# EAGLE design untitled (EAGLE 6.1)
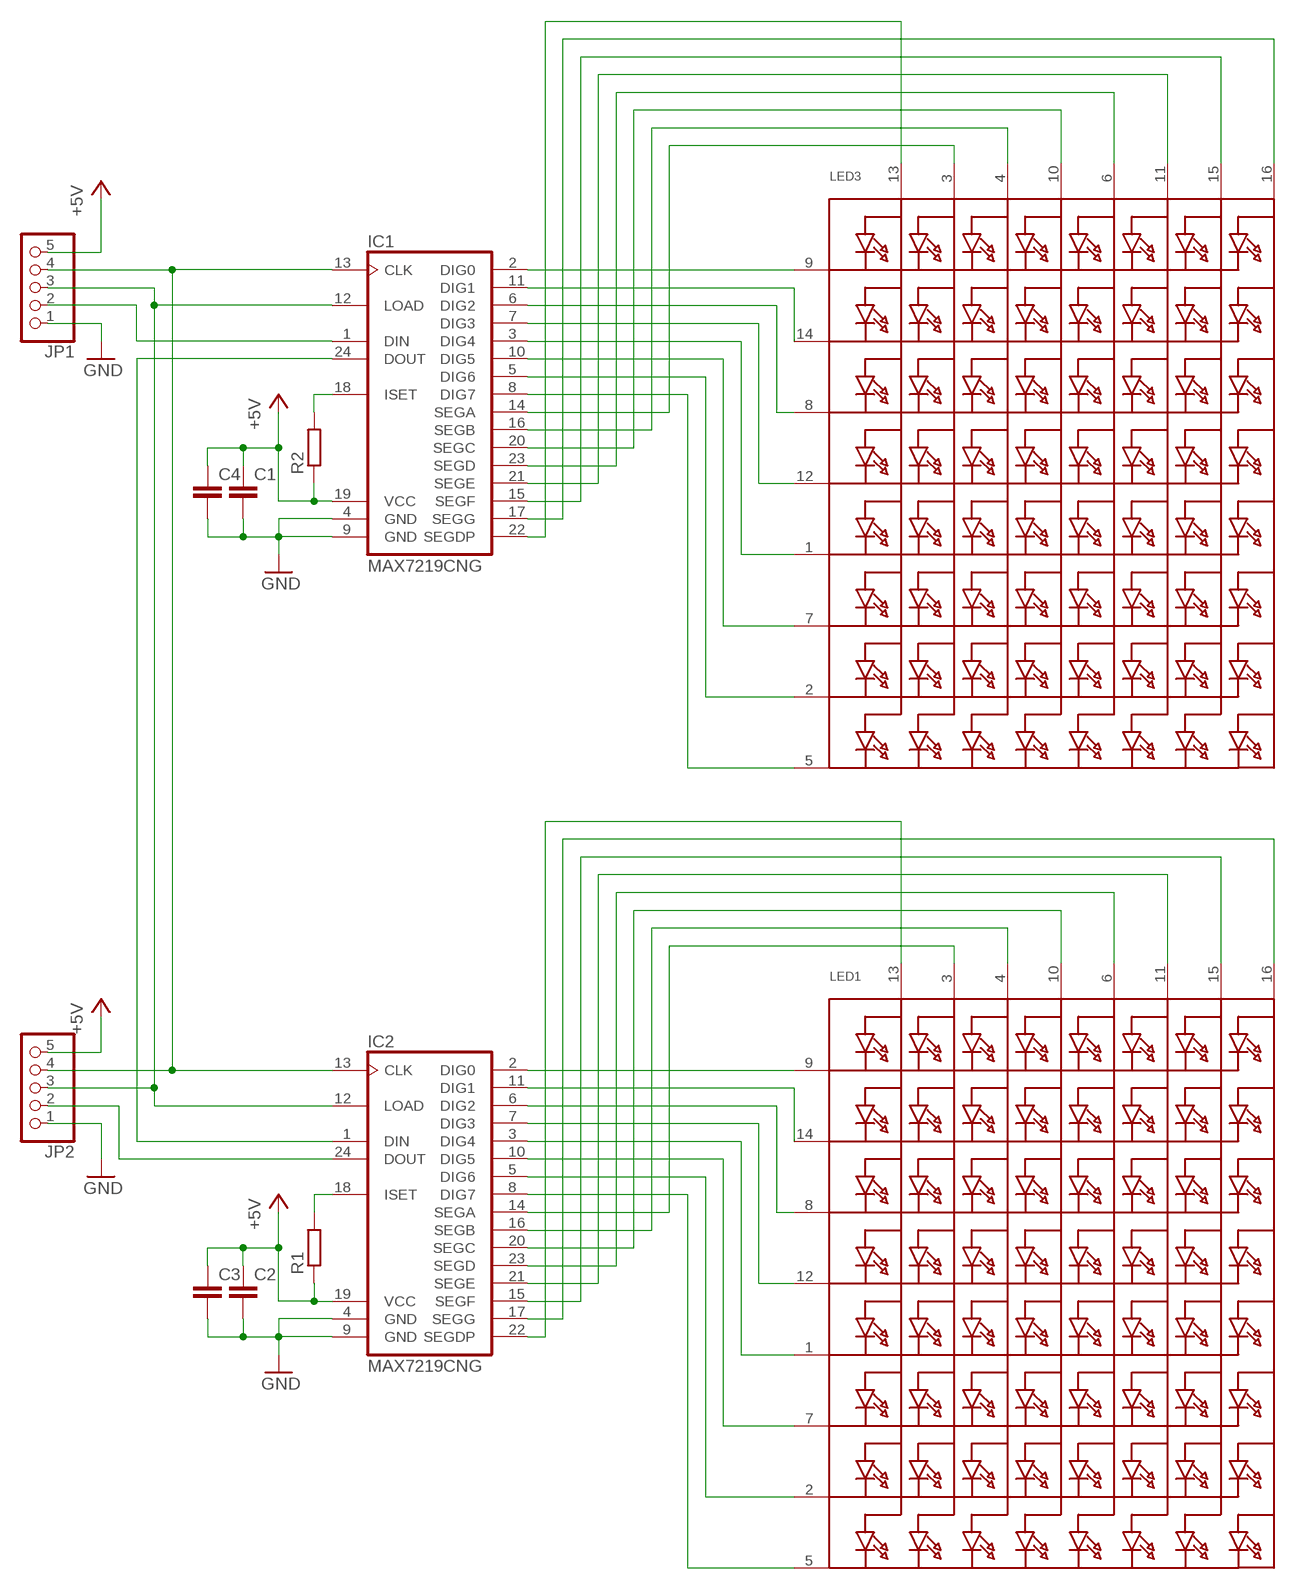
[diagram p0: schematic, sheet 1]

## Parts
C1  C-EUC0805K  [C0805K]
C2  C-EUC0805K  [C0805K]
C3  C-EUC0805K  [C0805K]
C4  C-EUC0805K  [C0805K]
IC1  MAX7219CNG  [DIL24-3]
IC2  MAX7219CNG  [DIL24-3]
JP1  PINHD-1X5/90  [1X05/90]
JP2  PINHD-1X5/90  [1X05/90]
LED1  SEGMENT_8X8_ROWCATHODEM12A881UR  [SEGMENT_BL-M12A881UR]
LED3  SEGMENT_8X8_ROWCATHODEM12A881UR  [SEGMENT_BL-M12A881UR]
R1  R-EU_M0805  [M0805]
R2  R-EU_M0805  [M0805]

## Nets
+5V: C1.1 C2.1 C3.1 C4.1 IC1.19(VCC) IC2.19(VCC) JP1.5 JP2.5 R1.1 R2.1
GND: C1.2 C2.2 C3.2 C4.2 IC1.4(GND) IC1.9(GND) IC2.4(GND) IC2.9(GND) JP1.1 JP2.1
N$1: IC1.2(DIG0) LED3.9(K1)
N$2: IC1.11(DIG1) LED3.14(K2)
N$3: IC1.6(DIG2) LED3.8(K3)
N$4: IC1.7(DIG3) LED3.12(K4)
N$5: IC1.3(DIG4) LED3.1(K5)
N$6: IC1.10(DIG5) LED3.7(K6)
N$7: IC1.5(DIG6) LED3.2(K7)
N$8: IC1.8(DIG7) LED3.5(K8)
N$9: IC1.14(SEGA) LED3.3(A2)
N$10: IC1.16(SEGB) LED3.4(A3)
N$11: IC1.20(SEGC) LED3.10(A4)
N$12: IC1.23(SEGD) LED3.6(A5)
N$13: IC1.21(SEGE) LED3.11(A6)
N$14: IC1.15(SEGF) LED3.15(A7)
N$15: IC1.17(SEGG) LED3.16(A8)
N$16: IC1.22(SEGDP) LED3.13(A1)
N$17: IC2.2(DIG0) LED1.9(K1)
N$18: IC2.11(DIG1) LED1.14(K2)
N$19: IC2.6(DIG2) LED1.8(K3)
N$20: IC2.7(DIG3) LED1.12(K4)
N$21: IC2.3(DIG4) LED1.1(K5)
N$22: IC2.10(DIG5) LED1.7(K6)
N$23: IC2.5(DIG6) LED1.2(K7)
N$24: IC2.8(DIG7) LED1.5(K8)
N$25: IC2.14(SEGA) LED1.3(A2)
N$26: IC2.16(SEGB) LED1.4(A3)
N$27: IC2.20(SEGC) LED1.10(A4)
N$28: IC2.23(SEGD) LED1.6(A5)
N$29: IC2.21(SEGE) LED1.11(A6)
N$30: IC2.15(SEGF) LED1.15(A7)
N$31: IC2.17(SEGG) LED1.16(A8)
N$32: IC2.22(SEGDP) LED1.13(A1)
N$33: IC2.24(DOUT) JP2.2
N$36: IC1.13(CLK) IC2.13(CLK) JP1.4 JP2.4
N$37: IC1.12(LOAD) IC2.12(LOAD) JP1.3 JP2.3
N$38: IC1.24(DOUT) IC2.1(DIN)
N$39: IC1.18(ISET) R2.2
N$40: IC2.18(ISET) R1.2
N$42: IC1.1(DIN) JP1.2

## Library data of the parts
C1-C4 = rcl:C-EU: CAPACITOR, European symbol
IC1 IC2 = maxim:MAX7219CNG: LED DISPLAY DRIVER; MF: MAXIM; MPN: MAX7219CNG; OC_FARNELL: 1523914; OC_NEWARK: 34C4018
JP1 JP2 = pinhead:PINHD-1X5: PIN HEADER
LED1 LED3 = adafruit:SEGMENT_8X8_ROWCATHODE: 8x8 LED Segment Displays: Row = Cathode 0.7" Red 8X8 Matrix, 1.9mm Round LEDs - BL-M07C881UR 1.2" Red 8x8 Matrix, 3.0mm Round LEDs - BL-M12A881UR 1.2" Red 8x8 Matrix, 3.0mm Square LEDs - BL-M12A883
R1 R2 = rcl:R-EU_: RESISTOR, European symbol

## Board
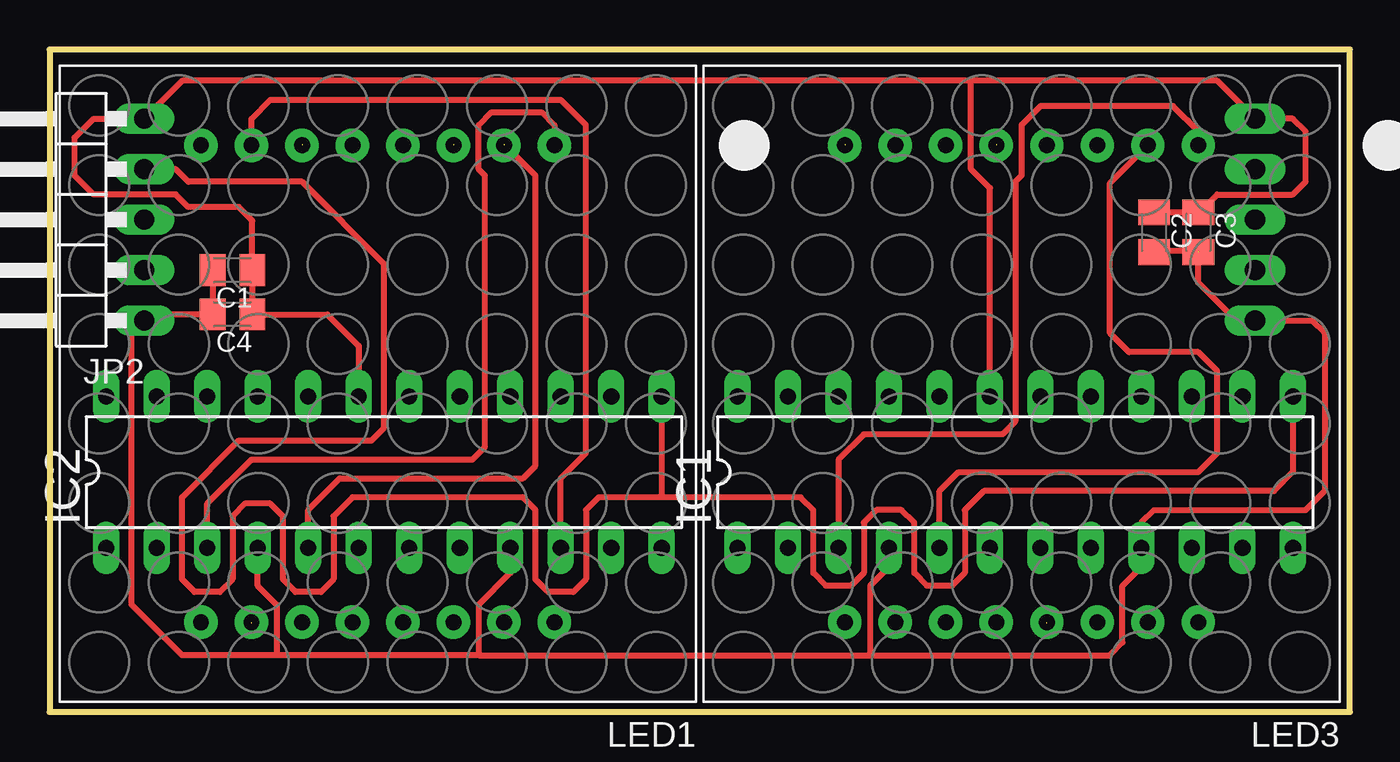
[diagram p1: board, top side]
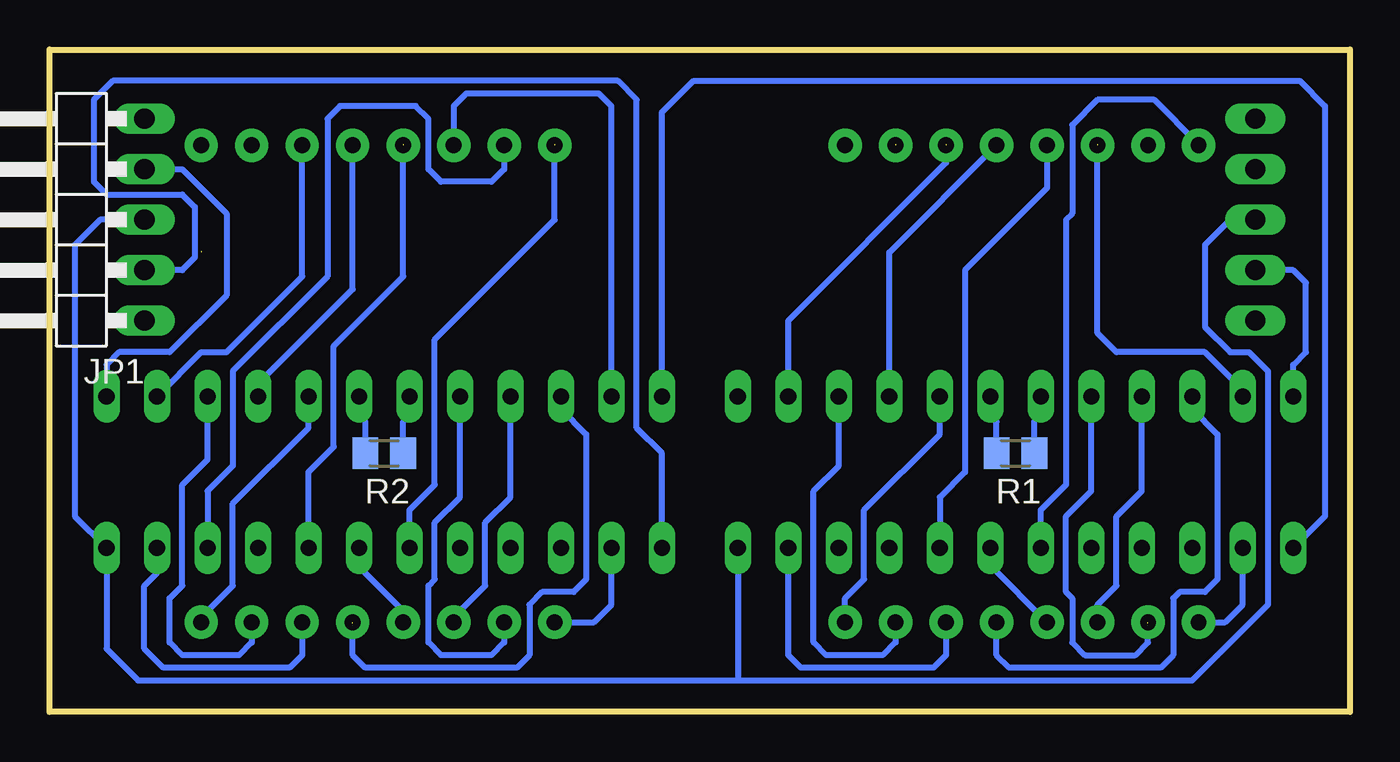
[diagram p2: board, bottom side, seen from below]

Size 65.39 x 33.32 mm. Coordinates in mm from the lower left corner, seen from the top.
Outline: 65.39,0 65.39,33.32 0,33.32 0,0 65.39,0
Copper layers (1*16): Top 0.035mm / dielectric 1.5mm / Bottom 0.035mm
Design rules: minimum track width 10mil, minimum drill 24mil, track to track 12mil, track to pad 12mil, pad to pad 12mil, via to via 12mil, smd to smd 10mil, copper to edge 12mil, drill to drill 12mil, minimum pad ring 10mil, minimum via ring 10mil, stop-mask expansion 4mil, vias tented up to drill 0mil, thermal gap 12mil

### Footprints (pad centres in the part's own frame; a part is rotated, then mirrored left to right if it is on the bottom)
C0805K = smd 1.3 x 1.6: 1 -1,0; 2 1,0
DIL24-3 = drill 0.813 long: 1 -13.97,-3.81; 2 -11.43,-3.81; 3 -8.89,-3.81; 4 -6.35,-3.81; 5 -3.81,-3.81; 6 -1.27,-3.81; 7 1.27,-3.81; 8 3.81,-3.81; 9 6.35,-3.81; 10 8.89,-3.81; 11 11.43,-3.81; 12 13.97,-3.81; 13 13.97,3.81; 14 11.43,3.81; 15 8.89,3.81; 16 6.35,3.81; 17 3.81,3.81; 18 1.27,3.81; 19 -1.27,3.81; 20 -3.81,3.81; 21 -6.35,3.81; 22 -8.89,3.81; 23 -11.43,3.81; 24 -13.97,3.81
1X05/90 = drill 1.016 long: 1 -5.08,-3.81; 2 -2.54,-3.81; 3 0,-3.81; 4 2.54,-3.81; 5 5.08,-3.81
SEGMENT_BL-M12A881UR = drill 0.8 pad 1.676: 1 -8.89,-12; 2 -6.35,-12; 3 -3.81,-12; 4 -1.27,-12; 5 1.27,-12; 6 3.81,-12; 7 6.35,-12; 8 8.89,-12; 9 8.89,12; 10 6.35,12; 11 3.81,12; 12 1.27,12; 13 -1.27,12; 14 -3.81,12; 15 -6.35,12; 16 -8.89,12
M0805 = smd 1.3 x 1.6: 1 -0.95,0; 2 0.95,0

### Placement (x,y rotation side)
C1  9.2,22.23 180 top
C2  55.55,24.13 270 top
C3  57.77,24.13 270 top
C4  9.2,20 180 top
IC1  48.56,12.06 0 top
IC2  16.81,12.06 0 top
JP1  64.44,24.77 90 bottom
JP2  0.94,24.77 90 top
LED1  16.5,16.51 180 top
LED3  48.88,16.51 180 top
R1  16.81,13.02 180 bottom
R2  48.56,13.02 180 bottom

### Tracks (layer width: path | path; a pad name or v marks a point on that pad's centre or on a via)
+5V
  Top 0.305: 46.34,31.75 58.73,31.75 JP1.5 62.53,29.85 63.17,29.21 63.17,26.67 62.53,26.04 58.73,26.04 57.82,25.13 C3.1 C2.1 | 46.34,31.75 6.65,31.75 JP2.5 2.21,29.85 1.26,28.89 1.26,26.99 2.21,26.04 6.34,26.04 6.97,25.4 9.51,25.4 10.2,24.72 C1.1 C4.1 13.96,20 15.54,18.42 IC2.19 | IC1.19 47.3,26.35 46.34,27.31 46.34,31.75
  Bottom 0.305: R1.1 15.86,14.6 15.54,14.92 IC2.19 | R2.1 47.61,14.6 47.3,14.92 IC1.19
GND  (1 unrouted)
  Top 0.305: 21.58,2.86 41.26,2.86 | 41.26,2.86 53.33,2.86 53.96,3.49 53.96,6.35 54.92,7.3 IC1.9 54.92,9.53 55.55,10.16 63.17,10.16 64.12,11.11 64.12,19.05 63.49,19.69 JP1.1 59.68,19.69 57.77,21.59 57.77,23.18 55.6,23.18 C2.2 | IC1.4 42.22,7.3 41.26,6.35 41.26,2.86 | IC2.9 23.17,6.98 21.58,5.4 21.58,2.86 | 21.58,2.86 11.42,2.86 | IC2.4 10.46,6.35 11.42,5.4 11.42,2.86 | 11.42,2.86 6.65,2.86 4.11,5.4 4.11,19.05 JP2.1 5.07,20 C4.2 C1.2
N$1
  Bottom 0.305: LED3.9 38.02,4.51 37.14,5.4 IC1.2
N$2
  Bottom 0.305: LED3.14 52.69,2.86 53.33,2.22 59.68,2.22 60.63,3.17 60.63,6.35 60,6.98 IC1.11
N$3  (1 unrouted)
  Bottom 0.305: IC1.6 47.3,10.16 46.03,11.43 46.03,18.73 39.99,24.77 39.99,28.58
N$4
  Bottom 0.305: LED3.12 47.61,5.08 49.84,7.3 IC1.7
N$5
  Top 0.305: LED3.1 57.77,29.21 56.5,30.48 49.84,30.48 48.88,29.53 48.88,26.99 48.56,26.67 48.56,14.61 47.93,13.97 40.94,13.97 39.67,12.7 IC1.3
N$6
  Bottom 0.305: LED3.7 42.53,27.31 43.17,26.67 45.71,26.67 46.34,27.31 46.34,29.85 46.98,30.48 50.79,30.48 51.42,29.85 51.42,21.91 56.19,17.15 56.19,12.38 57.45,11.11 IC1.10
N$7
  Top 0.305: IC1.5 44.75,11.11 45.71,12.06 57.77,12.06 58.73,13.02 58.73,17.15 57.77,18.1 54.28,18.1 53.33,19.05 53.33,26.61 LED3.2
N$8  (1 unrouted)
  Bottom 0.305: IC1.8 52.38,12.06 51.11,13.33 51.11,18.42 47.61,21.91 47.61,28.58
N$9
  Bottom 0.305: IC1.14 57.77,18.1 56.5,18.1 52.69,21.91 LED3.3
N$10
  Bottom 0.305: IC1.16 54.92,16.51 50.15,21.27 LED3.4
N$11
  Bottom 0.305: LED3.10 42.53,3.49 43.17,2.86 45.71,2.86 46.34,3.49 46.34,6.35 46.03,6.67 46.03,9.53 44.75,10.79 IC1.20
N$12
  Bottom 0.305: IC1.23 37.14,30.48 37.77,31.12 44.44,31.12 45.07,30.48 LED3.6
N$13
  Bottom 0.305: LED3.11 45.07,4.76 43.48,6.35 43.48,9.53 42.22,10.79 IC1.21
N$14
  Bottom 0.305: LED3.15 55.23,3.49 55.87,2.86 58.73,2.86 59.36,3.49 59.36,5.71 58.73,6.35 58.73,11.43 57.45,12.7 IC1.15
N$15
  Bottom 0.305: LED3.16 57.77,4.76 56.19,6.35 56.19,10.48 52.38,14.29 IC1.17
N$16  (1 unrouted)
  Bottom 0.305: IC1.22 39.67,15.24 38.41,13.97 38.41,6.67 39.04,6.03 40.63,6.03 41.26,5.4 41.26,2.86 41.9,2.22 49.52,2.22 50.15,2.86 50.15,4.45
N$17
  Bottom 0.305: LED1.9 6.27,4.51 5.38,5.4 IC2.2
N$18
  Bottom 0.305: LED1.14 20.31,2.86 20.94,2.22 27.61,2.22 28.25,2.86 IC2.11
N$19
  Bottom 0.305: IC2.6 15.54,10.16 14.27,11.43 14.27,24.77 13.96,25.08 13.96,29.53 12.69,30.8 9.83,30.8 7.61,28.58 LED1.8
N$20
  Bottom 0.305: IC2.7 18.08,7.37 LED1.12
N$21
  Top 0.305: IC2.3 7.93,10.48 10.15,12.7 21.26,12.7 21.89,13.33 21.89,26.99 21.58,27.31 21.58,29.53 22.21,30.16 24.75,30.16 25.39,29.53 LED1.1
N$22
  Top 0.305: LED1.7 10.15,29.85 11.1,30.8 25.71,30.8 26.97,29.53 26.97,13.02 25.71,11.75 IC2.10
N$23  (1 unrouted)
  Top 0.305: IC2.5 13,10.16 14.59,11.75 23.8,11.75 24.43,12.38 24.43,26.99 22.85,28.58
N$24
  Bottom 0.305: LED1.5 15.23,26.35 19.36,22.23 19.36,12.06 20.62,10.79 IC2.8
N$25  (1 unrouted)
  Bottom 0.305: IC2.14 28.25,19.69 20.31,27.62 20.31,28.58
N$26
  Bottom 0.305: IC2.16 23.17,23.11 LED1.4
N$27  (1 unrouted)
  Bottom 0.305: IC2.20 13,11.11 14.27,9.84 14.27,6.03 13.96,5.71 13.96,3.49 13.32,2.86 10.78,2.86 10.15,3.49 10.15,4.45
N$28  (1 unrouted)
  Bottom 0.305: IC2.23 5.38,16.19 7.29,18.1 11.73,18.1 12.69,19.05 12.69,28.58
N$29
  Bottom 0.305: LED1.11 12.69,5.4 11.73,6.35 11.73,9.84 10.46,11.11 IC2.21
N$30
  Bottom 0.305: LED1.15 22.85,3.49 23.48,2.86 26.34,2.86 26.97,3.49 26.97,11.11 25.71,12.38 IC2.15
N$31
  Bottom 0.305: LED1.16 25.39,5.71 24.43,6.67 24.43,10.16 20.62,13.97 IC2.17
N$32
  Bottom 0.305: IC2.22 7.93,15.24 6.65,13.97 6.65,6.67 7.29,6.03 8.56,6.03 8.88,5.71 8.88,2.86 9.51,2.22 17.13,2.22 17.77,2.86 LED1.13
N$33
  Bottom 0.305: IC2.24 2.84,17.46 2.21,18.1 2.21,21.59 2.84,22.23 JP2.2
N$36
  Top 0.305: IC1.13 62.53,12.06 61.58,11.11 46.98,11.11 46.03,10.16 46.03,6.98 45.39,6.35 44.12,6.35 43.48,6.98 43.48,9.53 42.85,10.16 41.58,10.16 40.94,9.53 40.94,6.98 40.31,6.35 39.04,6.35 38.41,6.98 38.41,10.16 37.77,10.79 30.79,10.79 | 30.79,10.79 27.61,10.79 26.97,10.16 26.97,6.67 26.34,6.03 25.07,6.03 24.43,6.67 24.43,10.16 23.8,10.79 15.23,10.79 14.27,9.84 14.27,6.67 13.64,6.03 12.37,6.03 11.73,6.67 11.73,9.84 11.1,10.48 9.83,10.48 9.2,9.84 9.2,6.67 8.56,6.03 7.29,6.03 6.65,6.67 6.65,10.79 9.51,13.65 16.18,13.65 16.81,14.29 16.81,22.54 12.69,26.67 6.97,26.67 6.34,27.31 JP2.4 | IC2.13 30.79,10.79
  Bottom 0.305: JP1.4 58.73,27.31 56.5,25.08 56.5,20.96 59.36,18.1 61.9,18.1 62.53,17.46 IC1.13
N$37
  Bottom 0.305: JP1.3 62.85,24.77 64.12,23.5 64.12,9.84 IC1.12 62.53,3.17 60.95,1.59 30.79,1.59 | IC2.12 30.79,1.59 | 30.79,1.59 7.93,1.59 4.11,5.4 4.11,17.15 5.07,18.1 6.02,18.1 7.29,19.37 7.29,23.5 6.02,24.77 JP2.3
N$38
  Bottom 0.305: IC1.24 34.59,30.16 33.01,31.75 2.53,31.75 1.26,30.48 1.26,9.84 IC2.1
N$39
  Bottom 0.305: R2.2 49.52,14.6 49.84,14.92 IC1.18
N$40
  Bottom 0.305: R1.2 17.76,14.6 18.08,14.92 IC2.18
N$42
  Bottom 0.305: IC1.1 34.59,13.02 35.86,14.29 35.86,30.8 36.82,31.75 62.22,31.75 63.17,30.8 63.17,26.67 62.53,26.04 58.73,26.04 58.09,25.4 58.09,22.86 58.73,22.23 JP1.2